# EasyEDA Pro project slimarm_apricot.eprj, board PCB1
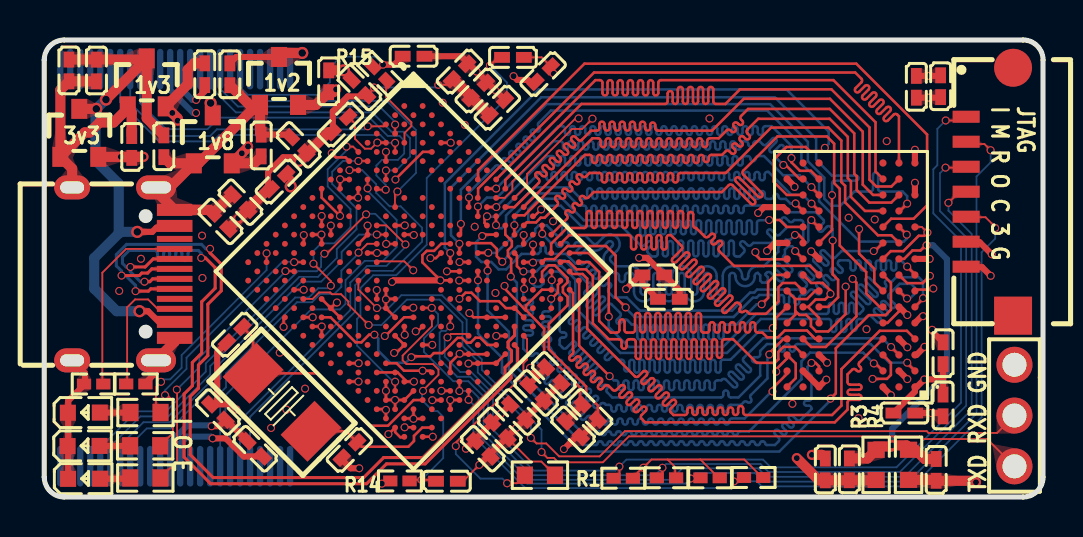
[diagram p1: board, top side]
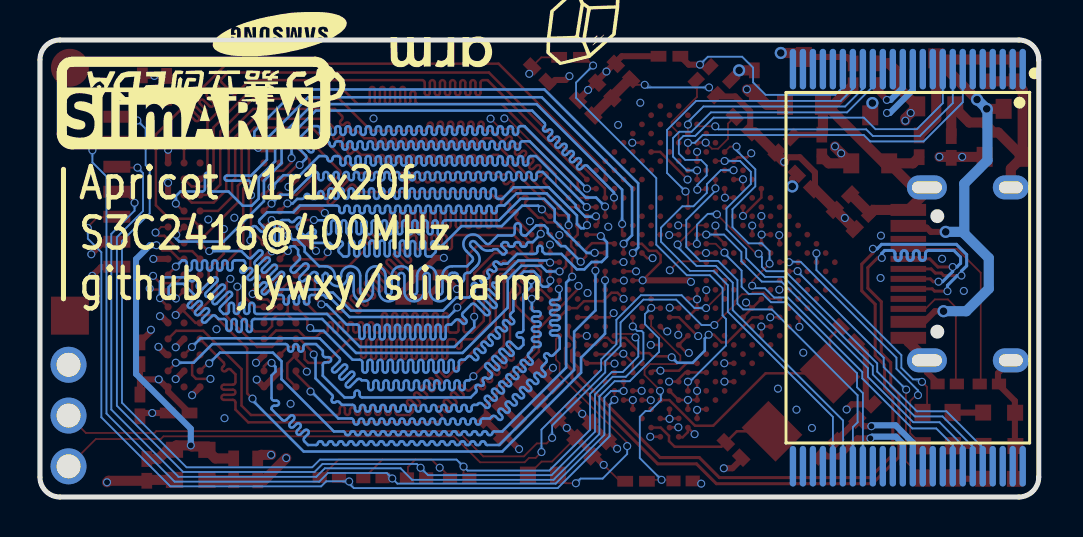
[diagram p2: board, bottom side, seen from below]

Outline 49.98 x 22.86 mm; copper layers: Top Layer, Inner1, Inner2, Bottom Layer. Coordinates in mm from the lower left corner of the outline.
Outline path: 0,21.86 0,1 arc(0.29,0.29) 1,0 48.98,0 arc(49.69,0.29) 49.98,1 49.98,21.86 arc(49.69,22.57) 48.98,22.86 1,22.86 arc(0.29,22.57) 0,21.86
Stack: Top Layer 0.035mm / Dielectric1 0.347mm PP er 4.5 / Inner1 0.035mm / Dielectric2 0.347mm FR4 er 4.5 / Inner2 0.035mm / Dielectric3 0.347mm PP er 4.5 / Bottom Layer 0.035mm

## Design rules (mm)
net DDR_CLKN: DDRCLK
net DDR_CLKP: DDRCLK
net USB_DN: USB
net USB_DP: USB
template: 自定义配置
spacing copperThickness1oz (default): track to track 0.089, other pairs 0.089 to 0.3
spacing copperThickness2oz: track to track 0.203, other pairs 0.152 to 0.3
track width copperThickness1oz (default): min 0.089, default 0.089, max 2.54
track width copperThickness2oz: min 0.089, default 0.089, max 2.54
differential pair DDRCLK (default): width min 0.089, default 0.127, max 2.54; gap min 0.203, default 0.203
differential pair USB: width min 0.142, default 0.142, max 2.54; gap min 0.152, default 0.152
via viaSize (default): diameter min 0.399, default 0.399, max 10; hole min 0.3, default 0.3, max 6.299
net DDR_D14 uses DDR
net DDR_D12 uses DDR
net DDR_D6 uses DDR
net DDR_D9 uses DDR
net DDR_D1 uses DDR
net DDR_A14_BA0 uses DDR
net DDR_A10 uses DDR
net DDR_A3 uses DDR
net DDR_A7 uses DDR
net DDR_A12 uses DDR
net DDR_D11 uses DDR
net DDR_D3 uses DDR
net DDR_A15_BA1 uses DDR
net DDR_A1 uses DDR
net DDR_A5 uses DDR
net DDR_A9 uses DDR
net DDR_D10 uses DDR
net DDR_D2 uses DDR
net DDR_A2 uses DDR
net DDR_A6 uses DDR
net DDR_A11 uses DDR
net DDR_D8 uses DDR
net DDR_D0 uses DDR
net DDR_A0 uses DDR
net DDR_A4 uses DDR
net DDR_A8 uses DDR
net DDR_D15 uses DDR
net DDR_D13 uses DDR
net DDR_D7 uses DDR
net DDR_D5 uses DDR
net DDR_RAS uses DDR
net DDR_UDQS uses DDR
net DDR_CS uses DDR
net DDR_CLKN uses DDR
net DDR_WE uses DDR
net DDR_D4 uses DDR
net DDR_LDQS uses DDR
net DDR_UDQM uses DDR
net DDR_SCKE uses DDR
net DDR_LDQM uses DDR
net DDR_CLKP uses DDR
net DDR_CAS uses DDR
net USB_DN uses USB
net USB_DP uses USB
diff pair USB uses USB
eq len grp DDR uses DDR
pour e13763 uses copperRegion1
pour e1405 uses copperRegion1

## Placement (name value [footprint] x y rotation side)
C1  22pF  [C0402]  15.28 2.35 45 top
C2  22pF  [C0402]  9.53 8.12 45 top
C3  100nF  [C0402]  44.64 1.36 90 top
C4  100nF  [C0402]  40.29 1.38 90 top
C5  100nF  [C0402]  1.24 21.34 270 top
C6  100nF  [C0402]  4.38 17.51 90 top
C7  100nF  [C0402]  5.99 17.54 270 top
C8  100nF  [C0402]  8.03 21.15 270 top
C9  100nF  [C0402]  2.61 21.33 270 top
C10  100nF  [C0402]  10.86 17.58 90 top
C11  100nF  [C0402]  9.29 21.14 270 top
C12  100nF  [C0402]  14.23 20.8 90 top
C13  100nF  [C0402]  14.83 18.63 45 top
C14  100nF  [C0402]  20.78 21.28 45 top
C15  100nF  [C0402]  11.72 15.78 45 top
C17  100nF  [C0402]  15.77 20.49 135 top
C18  100nF  [C0402]  12.73 17.61 135 top
C19  100nF  [C0402]  9.82 14.75 135 top
C20  100nF  [C0402]  8.82 13.79 135 top
C22  100nF  [C0402]  31.26 9.89 0 top
C23  100nF  [C0402]  30.48 11.11 0 top
C24  100nF  [C0402]  24.97 21.15 45 top
C25  100nF  [C0402]  26.46 3.39 315 top
C26  100nF  [C0402]  27.32 4.26 315 top
C27  100nF  [C0402]  22.67 19.47 45 top
C28  100nF  [C0402]  21.72 20.34 45 top
C30  100nF  [C0402]  21.95 2.41 315 top
C31  100nF  [C0402]  23.7 4.25 315 top
C32  100nF  [C0402]  8.69 4.25 135 top
C33  100nF  [C0402]  22.8 3.34 315 top
C34  100nF  [C0402]  10.55 2.41 315 top
C35  100nF  [C0402]  25.5 6.11 315 top
C36  100nF  [C0402]  24.62 5.2 315 top
C37  100nF  [C0402]  43.64 20.52 90 top
C38  100nF  [C0402]  44.86 20.55 90 top
C39  100nF  [C0402]  39.09 1.38 90 top
C40  100nF  [C0402]  43.04 4.2 0 top
C41  100nF  [C0402]  44.98 4.58 270 top
C42  100nF  [C0402]  44.98 7.19 90 top
C43  100nF  [C0402]  18.48 22.05 0 top
C44  100nF  [C0402]  20.15 0.79 0 top
C45  100nF  [C0402]  23.46 21.99 0 top
CN1  AFC12-S07DCA-00  [conn-smd_afc12-s07dca-00]  47.55 15.27 90 top
H1  2.54-1*3P针  [hdr-th_3p-p2.54-v-m-1]  48.55 4.07 270 top
LED1  NCD0603R1  [LED0603-RD_RED]  1.97 2.55 0 top
LED2  NCD0603R1  [LED0603-RD_RED]  1.98 4.22 0 top
LED3  NCD0603R1  [LED0603-RD_RED]  2 0.91 0 top
R1  44.2Ω  [R0603]  24.81 1.09 0 top
R3  2kΩ  [R0603]  41.63 1.61 270 top
R4  2kΩ  [R0603]  43.25 1.61 90 top
R5  1kΩ  [R0603]  5.05 2.56 180 top
R6  1kΩ  [R0603]  5.07 4.23 180 top
R7  1kΩ  [R0603]  5.06 0.95 180 top
R8  5.1kΩ  [R0402]  2.47 5.65 0 top
R9  5.1kΩ  [R0402]  4.58 5.65 180 top
R10  10kΩ  [R0402]  28.98 0.94 0 top
R11  10kΩ  [R0402]  33.32 0.96 0 top
R12  10kΩ  [R0402]  31.14 0.96 0 top
R13  5.1kΩ  [R0402]  35.5 0.98 0 top
R14  5.1kΩ  [R0402]  17.8 0.8 180 top
R15  5.1kΩ  [R0402]  16.8 21.18 135 top
U1  S3C2416_SCH  [S3C2416-XH40]  18.48 11.28 315 top
U3  K9F2G08U0C-SCBO  [tsop-48_l12.0-w18.4-p0.50-ls20.0-bl]  6.55 11.47 0 bottom
U4  NT5TU32M16FG-AC  [VFBGA-84_L7.5-W12.2-P0.80-TL_NANYA_NT5TU32M16FG]  40.37 11.11 180 top
U6  XC6206-3.3V  [SSOT-3_L2.9-W1.6-P0.95-LS2.8-BR]  1.76 18.21 270 top
U7  XC6206-3.3V  [SSOT-3_L2.9-W1.6-P0.95-LS2.8-BR]  5.13 20.74 270 top
U8  XC6206-3.3V  [SSOT-3_L2.9-W1.6-P0.95-LS2.8-BR]  8.43 17.89 270 top
U9  XC6206-3.3V  [SSOT-3_L2.9-W1.6-P0.95-LS2.8-BR]  11.75 20.81 270 top
USB2  TYPE-C 16PIN 2MD(073)  [USB-C-SMD_TYPE-C-6PIN-2MD-073]  3.77 11.16 270 top
X2  12MHz  [CRYSTAL-SMD_L5.0-W3.2]  11.9 4.74 315 top

## Footprints (pads in the part's own frame, mm; a bottom-side part is the same pattern mirrored in y, then rotated)
C0402
  rect 0.79x0.54 smd: 1(-0.545,0) 2(0.545,0)
conn-smd_afc12-s07dca-00
  rect 0.6x1.35 smd: 1(3.75,1.417) 2(2.5,1.417) 3(1.25,1.417) 4(0,1.417) 5(-1.25,1.417) 6(-2.5,1.417) 7(-3.75,1.417)
  rect 1.9x1.9 smd: 8(-6.2,-0.931)
  rrect 1.9x1.9 smd: 9(6.2,-0.931)
CRYSTAL-SMD_L5.0-W3.2
  rect 1.9x2.4 smd: 1(-2.05,0) 2(2.05,0)
hdr-th_3p-p2.54-v-m-1
  round 1.8 hole 1.2: 1(-2.54,0) 2(0,0) 3(2.54,0)
LED0603-RD_RED
  rect 0.8x0.8 smd: 1(-0.799,-0.004) 2(0.799,0.004)
R0402
  rect 0.711x0.54 smd: 1(-0.482,0) 2(0.482,0)
R0603
  rect 0.806x0.864 smd: 1(-0.753,0) 2(0.753,0)
S3C2416-XH40
  round 0.29 smd: A2(-5.525,6.175) A3(-4.875,6.175) A4(-4.225,6.175) A5(-3.575,6.175) A6(-2.925,6.175) A7(-2.275,6.175) A8(-1.625,6.175) A9(-0.975,6.175) A10(-0.325,6.175) A11(0.325,6.175) A12(0.975,6.175) A13(1.625,6.175) A14(2.275,6.175) A15(2.925,6.175) A16(3.575,6.175) A17(4.225,6.175) A18(4.875,6.175) A19(5.525,6.175) B1(-6.175,5.525) B2(-5.525,5.525) B3(-4.875,5.525) B4(-4.225,5.525) B5(-3.575,5.525) B6(-2.925,5.525) B7(-2.275,5.525) B8(-1.625,5.525) B9(-0.975,5.525) B10(-0.325,5.525) B11(0.325,5.525) B12(0.975,5.525) B13(1.625,5.525) B14(2.275,5.525) B15(2.925,5.525) B16(3.575,5.525) B17(4.225,5.525) B18(4.875,5.525) B19(5.525,5.525) B20(6.175,5.525) C1(-6.175,4.875) C2(-5.525,4.875) C3(-4.875,4.875) C4(-4.225,4.875) C5(-3.575,4.875) C6(-2.925,4.875) C7(-2.275,4.875) C8(-1.625,4.875) C9(-0.975,4.875) C10(-0.325,4.875) C11(0.325,4.875) C12(0.975,4.875) C13(1.625,4.875) C14(2.275,4.875) C15(2.925,4.875) C16(3.575,4.875) C17(4.225,4.875) C18(4.875,4.875) C19(5.525,4.875) C20(6.175,4.875) D1(-6.175,4.225) D2(-5.525,4.225) D3(-4.875,4.225) D4(-4.225,4.225) D5(-3.575,4.225) D6(-2.925,4.225) D7(-2.275,4.225) D8(-1.625,4.225) D9(-0.975,4.225) D10(-0.325,4.225) D11(0.325,4.225) D12(0.975,4.225) D13(1.625,4.225) D14(2.275,4.225) D15(2.925,4.225) D16(3.575,4.225) D17(4.225,4.225) D18(4.875,4.225) D19(5.525,4.225) D20(6.175,4.225) E1(-6.175,3.575) E2(-5.525,3.575) E3(-4.875,3.575) E4(-4.225,3.575) E17(4.225,3.575) E18(4.875,3.575) E19(5.525,3.575) E20(6.175,3.575) F1(-6.175,2.925) F2(-5.525,2.925) F3(-4.875,2.925) F4(-4.225,2.925) F7(-2.275,2.925) F8(-1.625,2.925) F9(-0.975,2.925) F10(-0.325,2.925) F11(0.325,2.925) F12(0.975,2.925) F13(1.625,2.925) F14(2.275,2.925) F17(4.225,2.925) F18(4.875,2.925) F19(5.525,2.925) F20(6.175,2.925) G1(-6.175,2.275) G2(-5.525,2.275) G3(-4.875,2.275) G4(-4.225,2.275) G6(-2.925,2.275) G8(-1.625,2.275) G9(-0.975,2.275) G10(-0.325,2.275) G11(0.325,2.275) G12(0.975,2.275) G13(1.625,2.275) G14(2.275,2.275) G15(2.925,2.275) G17(4.225,2.275) G18(4.875,2.275) G19(5.525,2.275) G20(6.175,2.275) H1(-6.175,1.625) H2(-5.525,1.625) H3(-4.875,1.625) H4(-4.225,1.625) H6(-2.925,1.625) H7(-2.275,1.625) H8(-1.625,1.625) H9(-0.975,1.625) H10(-0.325,1.625) H11(0.325,1.625) H12(0.975,1.625) H13(1.625,1.625) H14(2.275,1.625) H15(2.925,1.625) H17(4.225,1.625) H18(4.875,1.625) H19(5.525,1.625) H20(6.175,1.625) J1(-6.175,0.975) J2(-5.525,0.975) J3(-4.875,0.975) J4(-4.225,0.975) J6(-2.925,0.975) J7(-2.275,0.975) J8(-1.625,0.975) J13(1.625,0.975) J14(2.275,0.975) J15(2.925,0.975) J17(4.225,0.975) J18(4.875,0.975) J19(5.525,0.975) J20(6.175,0.975) K1(-6.175,0.325) K2(-5.525,0.325) K3(-4.875,0.325) K4(-4.225,0.325) K6(-2.925,0.325) K7(-2.275,0.325) K8(-1.625,0.325) K13(1.625,0.325) K14(2.275,0.325) K15(2.925,0.325) K17(4.225,0.325) K18(4.875,0.325) K19(5.525,0.325) K20(6.175,0.325) L1(-6.175,-0.325) L2(-5.525,-0.325) L3(-4.875,-0.325) L4(-4.225,-0.325) L6(-2.925,-0.325) L7(-2.275,-0.325) L8(-1.625,-0.325) L13(1.625,-0.325) L14(2.275,-0.325) L15(2.925,-0.325) L17(4.225,-0.325) L18(4.875,-0.325) L19(5.525,-0.325) L20(6.175,-0.325) M1(-6.175,-0.975) M2(-5.525,-0.975) M3(-4.875,-0.975) M4(-4.225,-0.975) M6(-2.925,-0.975) M7(-2.275,-0.975) M8(-1.625,-0.975) M13(1.625,-0.975) M14(2.275,-0.975) M15(2.925,-0.975) M17(4.225,-0.975) M18(4.875,-0.975) M19(5.525,-0.975) M20(6.175,-0.975) N1(-6.175,-1.625) N2(-5.525,-1.625) N3(-4.875,-1.625) N4(-4.225,-1.625) N6(-2.925,-1.625) N7(-2.275,-1.625) N8(-1.625,-1.625) N9(-0.975,-1.625) N10(-0.325,-1.625) N11(0.325,-1.625) N12(0.975,-1.625) N13(1.625,-1.625) N14(2.275,-1.625) N15(2.925,-1.625) N17(4.225,-1.625) N18(4.875,-1.625) N19(5.525,-1.625) N20(6.175,-1.625) P1(-6.175,-2.275) P2(-5.525,-2.275) P3(-4.875,-2.275) P4(-4.225,-2.275) P6(-2.925,-2.275) P7(-2.275,-2.275) P8(-1.625,-2.275) P9(-0.975,-2.275) P10(-0.325,-2.275) P11(0.325,-2.275) P12(0.975,-2.275) P13(1.625,-2.275) P15(2.925,-2.275) P17(4.225,-2.275) P18(4.875,-2.275) P19(5.525,-2.275) P20(6.175,-2.275) R1(-6.175,-2.925) R2(-5.525,-2.925) R3(-4.875,-2.925) R4(-4.225,-2.925) R7(-2.275,-2.925) R8(-1.625,-2.925) R9(-0.975,-2.925) R10(-0.325,-2.925) R11(0.325,-2.925) R12(0.975,-2.925) R13(1.625,-2.925) R14(2.275,-2.925) R17(4.225,-2.925) R18(4.875,-2.925) R19(5.525,-2.925) R20(6.175,-2.925) T1(-6.175,-3.575) T2(-5.525,-3.575) T3(-4.875,-3.575) T4(-4.225,-3.575) T17(4.225,-3.575) T18(4.875,-3.575) T19(5.525,-3.575) T20(6.175,-3.575) U1(-6.175,-4.225) U2(-5.525,-4.225) U3(-4.875,-4.225) U4(-4.225,-4.225) U5(-3.575,-4.225) U6(-2.925,-4.225) U7(-2.275,-4.225) U8(-1.625,-4.225) U9(-0.975,-4.225) U10(-0.325,-4.225) U11(0.325,-4.225) U12(0.975,-4.225) U13(1.625,-4.225) U14(2.275,-4.225) U15(2.925,-4.225) U16(3.575,-4.225) U17(4.225,-4.225) U18(4.875,-4.225) U19(5.525,-4.225) U20(6.175,-4.225) V1(-6.175,-4.875) V2(-5.525,-4.875) V3(-4.875,-4.875) V4(-4.225,-4.875) V5(-3.575,-4.875) V6(-2.925,-4.875) V7(-2.275,-4.875) V8(-1.625,-4.875) V9(-0.975,-4.875) V10(-0.325,-4.875) V11(0.325,-4.875) V12(0.975,-4.875) V13(1.625,-4.875) V14(2.275,-4.875) V15(2.925,-4.875) V16(3.575,-4.875) V17(4.225,-4.875) V18(4.875,-4.875) V19(5.525,-4.875) V20(6.175,-4.875) W1(-6.175,-5.525) W2(-5.525,-5.525) W3(-4.875,-5.525) W4(-4.225,-5.525) W5(-3.575,-5.525) W6(-2.925,-5.525) W7(-2.275,-5.525) W8(-1.625,-5.525) W9(-0.975,-5.525) W10(-0.325,-5.525) W11(0.325,-5.525) W12(0.975,-5.525) W13(1.625,-5.525) W14(2.275,-5.525) W15(2.925,-5.525) W16(3.575,-5.525) W17(4.225,-5.525) W18(4.875,-5.525) W19(5.525,-5.525) W20(6.175,-5.525) Y2(-5.525,-6.175) Y3(-4.875,-6.175) Y4(-4.225,-6.175) Y5(-3.575,-6.175) Y6(-2.925,-6.175) Y7(-2.275,-6.175) Y8(-1.625,-6.175) Y9(-0.975,-6.175) Y10(-0.325,-6.175) Y11(0.325,-6.175) Y12(0.975,-6.175) Y13(1.625,-6.175) Y14(2.275,-6.175) Y15(2.925,-6.175) Y16(3.575,-6.175) Y17(4.225,-6.175) Y18(4.875,-6.175) Y19(5.525,-6.175)
SSOT-3_L2.9-W1.6-P0.95-LS2.8-BR
  rect 1x0.8 smd: 1(1.2,-0.95) 2(1.2,0.95) 3(-1.2,0)
tsop-48_l12.0-w18.4-p0.50-ls20.0-bl
  oval 0.318x2.032 smd: 1(-5.75,-9.931) 2(-5.25,-9.931) 3(-4.75,-9.931) 4(-4.25,-9.931) 5(-3.75,-9.931) 6(-3.25,-9.931) 7(-2.75,-9.931) 8(-2.25,-9.931) 9(-1.75,-9.931) 10(-1.25,-9.931) 11(-0.75,-9.931) 12(-0.25,-9.931) 13(0.25,-9.931) 14(0.75,-9.931) 15(1.25,-9.931) 16(1.75,-9.931) 17(2.25,-9.931) 18(2.75,-9.931) 19(3.25,-9.931) 20(3.75,-9.931) 21(4.25,-9.931) 22(4.75,-9.931) 23(5.25,-9.931) 24(5.75,-9.931) 25(5.75,9.931) 26(5.25,9.931) 27(4.75,9.931) 28(4.25,9.931) 29(3.75,9.931) 30(3.25,9.931) 31(2.75,9.931) 32(2.25,9.931) 33(1.75,9.931) 34(1.25,9.931) 35(0.75,9.931) 36(0.25,9.931) 37(-0.25,9.931) 38(-0.75,9.931) 39(-1.25,9.931) 40(-1.75,9.931) 41(-2.25,9.931) 42(-2.75,9.931) 43(-3.25,9.931) 44(-3.75,9.931) 45(-4.25,9.931) 46(-4.75,9.931) 47(-5.25,9.931) 48(-5.75,9.931)
USB-C-SMD_TYPE-C-6PIN-2MD-073
  rect 0.6x1.778 smd: 1(-3.2,2.756) 2(-2.4,2.756) 11(2.4,2.756) 12(3.2,2.756)
  rect 0.3x1.778 smd: 3(-1.75,2.756) 4(-1.25,2.756) 5(-0.75,2.756) 6(-0.25,2.756) 7(0.25,2.756) 8(0.75,2.756) 9(1.25,2.756) 10(1.75,2.756)
  oval 1.2x2 hole 0.6x1.5: 13(-4.325,1.825) 14(4.325,1.825)
  oval 1.2x1.8 hole 0.6x1.2: 13(-4.325,-2.375) 14(4.325,-2.375)
VFBGA-84_L7.5-W12.2-P0.80-TL_NANYA_NT5TU32M16FG
  round 0.36 smd: A1(-3.2,5.6) A2(-2.4,5.6) A3(-1.6,5.6) A7(1.6,5.6) A8(2.4,5.6) A9(3.2,5.6) B1(-3.2,4.8) B2(-2.4,4.8) B3(-1.6,4.8) B7(1.6,4.8) B8(2.4,4.8) B9(3.2,4.8) C1(-3.2,4) C2(-2.4,4) C3(-1.6,4) C7(1.6,4) C8(2.4,4) C9(3.2,4) D1(-3.2,3.2) D2(-2.4,3.2) D3(-1.6,3.2) D7(1.6,3.2) D8(2.4,3.2) D9(3.2,3.2) E1(-3.2,2.4) E2(-2.4,2.4) E3(-1.6,2.4) E7(1.6,2.4) E8(2.4,2.4) E9(3.2,2.4) F1(-3.2,1.6) F2(-2.4,1.6) F3(-1.6,1.6) F7(1.6,1.6) F8(2.4,1.6) F9(3.2,1.6) G1(-3.2,0.8) G2(-2.4,0.8) G3(-1.6,0.8) G7(1.6,0.8) G8(2.4,0.8) G9(3.2,0.8) H1(-3.2,0) H2(-2.4,0) H3(-1.6,0) H7(1.6,0) H8(2.4,0) H9(3.2,0) J1(-3.2,-0.8) J2(-2.4,-0.8) J3(-1.6,-0.8) J7(1.6,-0.8) J8(2.4,-0.8) J9(3.2,-0.8) K2(-2.4,-1.6) K3(-1.6,-1.6) K7(1.6,-1.6) K8(2.4,-1.6) K9(3.2,-1.6) L1(-3.2,-2.4) L2(-2.4,-2.4) L3(-1.6,-2.4) L7(1.6,-2.4) L8(2.4,-2.4) M2(-2.4,-3.2) M3(-1.6,-3.2) M7(1.6,-3.2) M8(2.4,-3.2) M9(3.2,-3.2) N1(-3.2,-4) N2(-2.4,-4) N3(-1.6,-4) N7(1.6,-4) N8(2.4,-4) P2(-2.4,-4.8) P3(-1.6,-4.8) P7(1.6,-4.8) P8(2.4,-4.8) P9(3.2,-4.8) R1(-3.2,-5.6) R2(-2.4,-5.6) R3(-1.6,-5.6) R7(1.6,-5.6) R8(2.4,-5.6)

## Nets
As in the schematic.

Pads without a net: CN1 8 9; U1 A2 A3 A4 A5 A6 A7 A8 A9 B1 B2 B3 B4 B6 B7 B8 B15 B16 C1 C2 C3 C4 C6 C7 C8 C9 D4 D5 D6 D7 D8 D9 D14 D20 E1 E4 E18 E19 E20 F1 F2 F4 F7 F8 F9 F10 F17 F18 F19 F20 G3 G6 G8 G9 G10 G15 G17 G20 H7 H8 H9 H10 H15 H17 J1 J4 J6 J14 J15 J18 K1 K4 K13 K14 K15 K17 K18 L2 L4 L13 L14 L18 M1 M2 M3 M4 M15 M17 M20 N1 N2 N6 N7 N8 N9 N15 N17 N18 N19 N20 P1 P2 P6 P7 P9 P17 R1 R2 R4 R7 R8 R9 R10 R11 R12 R18 T1 T2 T3 T17 T18 U1 U2 U3 U5 U6 U10 U11 U12 U13 U19 U20 V1 V3 V4 V7 V9 V10 V11 V12 V13 W1 W2 W3 W4 W5 W6 W10 W11 W13 W14 W15 Y2 Y3 Y4 Y5 Y7 Y8 Y9 Y10 Y11 Y12 Y14 Y15; U3 1 2 3 4 5 6 10 11 14 15 20 21 22 23 24 25 26 27 28 33 34 35 38 39 40 45 46 47 48; U4 A2 A8 E2 E8 R3 R7 R8; USB2 3 9

## Via types
v1: diameter 0.4, hole 0.3, Top Layer to Bottom Layer, 234 vias
v2: diameter 0.399, hole 0.299, Top Layer to Bottom Layer, 25 vias
v3: diameter 0.61, hole 0.381, Top Layer to Bottom Layer, 8 vias

## Routing (per net, layer and track width the routed paths; a pad name or vN(x,y) marks a point on that pad's centre or on a via; arc(x,y) is an arc through that point)
1V2: length 36.5
  Top Layer w0.127: 23.07,8.07 23.06,8.06 v1(22.62,8.06) ; 20.32,5.31 v1(19.88,5.31)
  Top Layer w0.305: 24.7,6.06 C36.1 ; 24.7,6.06 25.12,6.47 C35.1 ; 24.7,6.06 24.7,6.08 v1(24.31,6.46)
  Top Layer w0.508: U9.2 13.59,19.61 C12.1 14.47,20.25 v1(14.61,20.39)
  Inner1 w0.127: 18.88,7.19 18.88,7.79 19.3,8.2 19.3,8.78 19.89,9.36 19.89,10.06 20.21,10.39 21.52,10.39 22.12,9.79 22.95,9.79 23.32,9.43 23.32,8.75 v1(22.62,8.06)
  Inner1 w0.305: v1(14.61,20.39) 15.34,19.66 17.51,19.66 18.21,18.96 18.21,17.94 18.89,17.26 18.89,14.22 19.2,13.91 19.2,12.77 17.91,11.48 17.91,9.75 17.53,9.37 17.53,7.97 17.84,7.67 18.41,7.67 18.88,7.19 19.88,6.2 v1(19.88,5.31) ; v1(22.62,8.06) 22.72,8.06 v1(24.31,6.46)
1V3: length 76.6
  Top Layer w0.089: 20.48,20.89 20.2,20.62 v2(19.72,20.62) ; v2(16.5,20.49) 16.5,20.44 C17.1 ; 12.5,10.37 v1(12.98,10.37)
  Top Layer w0.127: 13.88,13.59 v1(13.88,14.06) ; 13.42,8.53 v1(13.89,8.53) 13.88,8.52 13.88,8.07 ; v1(20.78,11.75) 21.23,11.75 21.24,11.75 ; 16.64,4.39 17.07,4.39 v1(17.1,4.36) 17.1,3.93 ; 20.32,10.83 20.31,10.84 v1(19.82,10.84) 18.93,11.74 18.93,12.1 19.14,12.31 19.51,12.31 19.86,12.67 20.32,12.67 ; v1(12.99,13.1) 12.99,12.69 12.96,12.67 ; 16.18,12.21 v1(16.65,12.21) 17.1,12.21 ; v1(18.59,8.29) 18.69,8.29 18.94,8.53 ; 18.02,13.13 18.47,13.13 v1(18.5,13.1) ; 15.26,15.88 14.81,15.88 v1(14.8,15.89) 14.8,15.42 ; 16.64,9.91 v1(16.64,10.35)
  Top Layer w0.305: C15.1 11.2,15.53 11.2,16.24 11.95,16.99 12.52,16.99 v1(12.75,16.76) ; v1(19.82,10.84) 17.48,10.84 v1(17.41,10.76) ; C13.1 14.44,19.29 15.19,20.04 15.92,20.04
  Top Layer w0.508: C20.1 11.2,15.39 C15.1 ; C13.1 14.23,18.25 v1(12.75,16.76) ; C8.1 7.5,21.69 7.18,21.37 7.18,20.64 U7.2 v1(6.41,19.21) 6.67,18.94 v1(6.67,18.82) ; 22.29,19.09 20.48,20.89 C14.1
  Inner1 w0.127: v1(20.78,11.75) 20.59,11.56 20.59,11.19 20.33,10.93 19.92,10.93 v1(19.82,10.84) 18.96,9.97 18.96,8.65 v1(18.59,8.29)
  Inner1 w0.254: 17.12,11.74 17.59,12.21 17.59,12.87 17.84,13.11 18.49,13.11 v1(18.5,13.1)
  Inner1 w0.305: v1(13.88,14.06) 13.88,15.63 v1(12.75,16.76) ; v1(13.88,14.06) 12.99,13.17 ; v1(13.88,14.06) 14.8,14.98 v1(14.8,15.89) ; v1(17.1,4.36) 16.45,5 16.45,6.94 15.6,7.79 ; 12.99,13.1 12.99,10.4 13.02,10.37 ; 13.02,10.37 v1(12.98,10.37) ; 13.02,10.37 14.86,8.53 ; 14.86,8.53 v1(13.89,8.53) ; 14.86,8.53 15.6,7.79 ; v1(16.65,12.21) 17.41,11.45 v1(17.41,10.76) 17,10.35 v1(16.64,10.35) 15.6,9.32 15.6,7.79
  Inner1 w0.508: 12.99,13.1 12.14,13.95 v1(9.7,13.95) 8.06,15.6 8.06,16.74 6.67,18.13 v1(6.67,18.82) 6.67,18.94 v1(6.41,19.21)
  Bottom Layer w0.089: v2(16.5,20.49) 19.59,20.49 v2(19.72,20.62)
1V8: length 194
  Top Layer w0.089: v1(27.43,18.92) 26.92,18.41 26.41,18.41 24.16,16.16 24.16,15.59 23.53,14.96
  Top Layer w0.127: 26.94,4.64 26.81,4.77 26.81,5.48 25.02,7.27 25.02,8.41 24.12,9.34 24.1,9.34 ; v1(41.45,5.91) 42.17,5.91 42.37,6.11 42.37,6.71 41.97,7.11 ; 43.57,10.31 43.64,10.38 44.44,10.38 v1(44.49,10.43) ; 37.58,9.31 37.78,9.11 38.13,9.11 38.37,8.87 38.37,8.55 38.63,8.28 39.24,8.28 40.11,9.15 v1(40.11,10.52) ; 37.58,9.31 37.58,9.9 ; 37.58,9.31 37.58,9.12 37.17,8.71 ; 37.17,5.51 37.61,5.94 37.61,6.68 37.17,7.11 37.17,6.93 36.63,6.39 v1(36.63,6.27) ; 18.02,9.45 18.04,9.47 v1(18.47,9.47) ; 37.17,11.91 37.16,11.89 35.82,11.89 35.59,12.12 v1(35.59,12.25) ; 24.1,9.34 24.09,9.34 23.03,10.43 v1(23.03,10.56) ; 24.1,9.34 24.11,9.35 24.11,9.57 24.91,10.37 25.37,10.37 ; 37.58,9.9 38.17,9.9 38.58,10.31 38.77,10.31 ; 37.58,9.9 37.17,10.31 ; v1(24.46,12.63) 24.46,12.21 24.45,12.21 ; 41.97,10.31 41.54,10.74 41.54,11.41 40.78,12.17 v1(40.78,13.4) ; v1(18.04,8.11) 18.02,8.13 18.02,8.53 ; 21.24,10.83 v1(20.76,10.83)
  Top Layer w0.305: C22.1 29.94,10.67 C23.1 29.82,11.11 v1(29.12,10.4) ; C25.1 26.94,4.63 26.94,4.64 ; C42.1 44.98,5.89 ; 44.98,5.89 C41.1 ; 44.98,5.89 44.97,5.88 v1(44.04,5.88) 43.67,5.51 43.57,5.51 43.57,5.27 C40.1 ; 43.57,8.71 43.91,9.05 v1(43.98,9.05) ; 43.57,16.71 v1(43.57,17.37) ; 38.77,7.11 39.17,6.72 v1(39.17,6.72) ; 43.57,11.91 v1(44.31,11.91) ; v1(35.73,14.21) 36.02,14.5 36.98,14.5 37.17,14.31 ; 24.22,20.86 23.68,20.86 v2(23.49,21.05) ; v1(44.05,7.51) 43.65,7.11 43.57,7.11 ; C38.1 44.83,19.97 v1(44.25,19.97) C37.1
  Top Layer w0.508: v1(10.2,17.54) 10.2,17.5 v1(9.89,17.19) U8.2 10.51,16.69 C10.1 ; v1(37.66,1.95) 38.77,0.83 C39.1 41.61,0.83 R3.2
  Inner1 w0.089: 24.46,12.38 24.59,12.25 25.45,12.25 26.02,12.82 28.5,12.82 29.1,12.23 29.1,10.42 v1(29.12,10.4)
  Inner1 w0.127: 22.97,11.12 22.97,11.3 23.15,11.48 23.57,11.48 24.46,12.38 v1(24.46,12.63) ; 22.97,11.12 22.97,10.56 ; 22.97,11.12 22.36,11.73 21.28,11.73 ; v1(27.43,18.92) 27.33,18.92 26.85,18.45 26.28,18.45 22.79,14.96 21.8,14.96 21.25,15.51 21.25,15.52 20.13,15.52 19.54,14.93
  Inner1 w0.305: 43.43,5.27 41.29,3.13 38.41,3.13 37.66,2.38 v1(37.66,1.95) ; 43.43,5.27 42.99,5.27 42.35,5.91 v1(41.45,5.91) ; 43.43,5.27 v1(44.04,5.88) ; v1(40.78,13.4) 40.78,12.14 41.46,11.46 41.67,11.46 41.99,11.14 ; 40.11,9.23 v1(40.11,10.52) 39.85,10.77 39.85,11.76 37.2,14.42 35.94,14.42 v1(35.73,14.21) 35.59,14.07 v1(35.59,12.25) ; 40.11,9.23 38.12,7.24 ; 40.11,9.23 40.39,9.51 41.82,9.51 41.99,9.69 41.99,11.14 ; v1(39.17,6.72) 39.13,6.72 38.6,7.24 38.12,7.24 ; 41.99,11.14 42,11.13 42.44,11.13 43.14,10.43 v1(44.49,10.43) ; 17.19,22.31 18.96,20.54 18.96,18.18 19.54,17.59 19.54,14.24 19.86,13.92 ; v2(23.49,21.05) 22.59,21.95 22.59,22.31 ; v1(18.04,8.11) 18.04,9.04 v1(18.47,9.47) 18.45,9.49 18.45,10.43 19.86,11.84 19.86,13.92 ; 19.86,13.92 20.64,13.14 21.07,13.14 21.28,12.93 21.28,11.31 20.8,10.83 v1(20.76,10.83) ; 38.12,7.24 37.6,7.24 v1(36.63,6.27)
  Inner1 w0.508: v1(44.04,5.88) 44.04,7.55 ; 44.04,7.55 43.65,7.94 43.65,8.72 v1(43.98,9.05) 44.19,9.05 44.63,9.48 44.63,10.3 v1(44.49,10.43) 44.55,10.43 44.92,10.8 44.92,11.3 ; 44.04,7.55 44.05,7.54 v1(44.05,7.51) ; 44.92,11.3 44.92,11.48 44.49,11.91 v1(44.31,11.91) ; 44.92,11.3 45.03,11.4 45.03,13.43 44.34,14.11 44.34,16.6 v1(43.57,17.37) 44.08,17.88 44.08,19.8 v1(44.25,19.97) 41.92,22.31 14,22.31 10.2,18.5 v1(10.2,17.54) 10.2,17.5 v1(9.89,17.19)
3V3: length 127.6
  Top Layer w0.089: 17.37,0.8 17.23,0.67 v2(16.89,0.67) ; 32.84,1.88 31.19,1.88 ; 32.84,1.88 35.03,1.88 35.93,0.98 ; 32.84,1.88 33.75,0.96 ; 31.19,1.88 30.39,1.88 v2(29.98,1.47) 29.94,1.47 29.41,0.94 ; 31.19,1.88 31.57,1.5 31.57,0.96 ; R15.2 16.85,21.52 v2(16.96,21.63)
  Top Layer w0.127: v1(17.51,7.21) 17.62,7.21 18.02,7.61 17.56,8.07 ; 15.26,6.69 v1(15.74,6.69) ; 16.64,6.23 17.69,6.23 18.15,5.77 v1(18.5,5.77) ; v1(11.98,8.51) 11.98,8.92 12.04,8.99 ; 19.4,17.26 18.94,17.26 17.58,15.89 v1(17.58,15.88) ; 23.99,8.99 23.53,9.45 23.1,9.45 22.76,9.79 21.81,9.79 21.38,10.22 21.08,10.22 v1(20.78,9.91) ; U1.P18 20.32,6.71 20.78,7.17 v1(20.79,7.17) 20.81,7.14 22.15,7.14 22.16,7.15 ; 15.26,16.8 15.08,16.99 14.6,16.99 v1(14.39,17.2) ; 19.86,4.85 19.85,4.84 v1(19.42,4.84) ; 17.1,16.8 v1(17.1,17.27) ; U1.N4 v2(14.34,13.58) ; v1(18.04,3.49) 18.46,3.49 18.48,3.47 ; 18.94,3.01 v1(19.44,3.01)
  Top Layer w0.305: 46.29,12.75 46.81,12.75 v1(47.42,12.14) ; v1(21.1,2.41) v1(22.85,4.16) C31.1 ; 10.17,2.8 9.1,3.86 C32.1 8.75,3.54 v1(8.38,3.54) ; C43.1 17.52,21.63 v2(16.96,21.63)
  Top Layer w0.508: 4.97,17.01 v1(3.83,17.01) U6.2
  Inner1 w0.089: v1(20.78,9.91) 20.78,7.18 v1(20.79,7.17)
  Inner1 w0.127: 16.36,16.53 16.36,16.75 15.84,17.26 15.45,17.26 15.31,17.11 14.47,17.11 ; 16.36,16.53 16.36,16.41 16.89,15.88 v1(17.58,15.88) 18.19,15.88 18.3,15.77 18.3,15.05 17.79,14.54 15.89,14.54 14.92,13.58 v2(14.34,13.58) ; 16.36,16.53 v1(17.1,17.27) ; 14.47,17.11 14.43,17.11 ; 14.47,17.11 v1(14.39,17.2) ; 13.83,17.71 13.83,20.55 14.05,20.77 16.1,20.77 v2(16.96,21.63)
  Inner1 w0.305: 21.32,2.64 v1(22.85,4.16) 22.64,4.16 20.51,6.29 20.51,6.89 20.79,7.17 ; 21.32,2.64 21.32,3.68 20.66,4.34 19.92,4.34 v1(19.42,4.84) 18.61,4.84 18.5,4.96 v1(18.5,5.77) 18.5,5.99 17.8,6.69 17.8,6.92 v1(17.51,7.21) ; 21.32,2.64 v1(21.1,2.41) 20.75,2.06 20.1,2.06 19.54,2.62 19.54,2.92 v1(19.44,3.01) 19.32,3.14 18.39,3.14 v1(18.04,3.49) 17.79,3.73 16.47,3.73 15.03,5.18 15.03,5.68 ; 15.03,5.68 15.03,5.98 v1(15.74,6.69) ; 15.03,5.68 13.24,7.47 13.02,7.47 v1(11.98,8.51) 11.98,9.81 7.16,14.62 7.16,15.96 6.1,17.02 v1(4.97,17.02) 4.97,18.85 6.08,19.95 6.82,19.95 8.06,18.71 8.06,18.05 9.55,16.56 11.29,16.56 12.59,17.86 13.73,17.86 v1(14.39,17.2)
  Bottom Layer w0.089: 9.8,21.34 9.8,20.5 10.19,20.12 13.67,20.12 14.29,20.74 14.29,21.47 14.84,22.02 16.56,22.02 v2(16.96,21.63) ; 15.69,6.68 15.7,6.69 v1(15.74,6.69)
  Bottom Layer w0.305: 6.3,1.6 6.3,2.73 7.16,3.59 8.33,3.59 v1(8.38,3.54) ; v1(7.6,19.21) 7.45,19.21 6.3,20.36 6.3,21.34
5V: length 47.5
  Top Layer w0.305: v3(4.66,13.26) 5.4,13.26 5.62,13.48 6.44,13.48 USB2.2 ; USB2.11 6.47,8.7 5.79,8.7 5.2,9.29 v3(4.77,9.29) ; U8.3 8.33,19.2 v3(8.33,19.71) ; 9.29,21.69 9.61,22.01 11.75,22.01
  Top Layer w0.508: 5.13,21.92 5.09,21.88 ; 5.13,21.92 5.13,18.94 C7.1 ; 5.13,21.92 U7.3 ; 5.09,21.88 C5.1 ; 5.09,21.88 v3(3.09,19.88) ; v3(12.91,22.21) 11.95,22.21 11.75,22.01 ; v3(2.61,19.41) U6.3
  Inner1 w0.508: v3(2.61,19.41) 2.63,19.41 4.2,20.98 7.58,20.98 8.33,20.23 v3(8.33,19.71) 9.47,19.71 11.97,22.21 v3(12.91,22.21)
  Bottom Layer w0.508: v3(4.77,9.29) 3.63,9.29 2.5,10.42 2.5,11.95 3.73,13.18 ; 3.73,13.18 3.81,13.26 v3(4.66,13.26) ; 3.73,13.18 3.73,15.67 2.57,16.84 2.57,19.38 v3(2.61,19.41) 3.07,19.88 v3(3.09,19.88)
GND: length 161.3
  Top Layer w0.089: 37.97,9.51 38.22,9.51 ; v1(18.47,11.34) 18.02,11.79 16.6,11.79 16.64,11.75 ; 24,21.99 24.9,21.99 C24.2 ; C33.2 24.36,1.77 24.88,1.77 R1.2 ; v1(44.2,13.23) 43.92,13.51 U4.L1 ; v1(21.77,1.61) 20.96,0.79 C44.2 ; v1(26.74,18.94) 26.58,18.94 23.43,15.78 23.43,15.35 23.04,14.96 22.62,14.96 ; 16.66,17.73 16.35,17.42 16.04,17.42 15.55,17.91 15.55,18.68 15.21,19.02
  Top Layer w0.127: 15.72,15.42 15.71,15.41 v1(15.71,14.97) 15.27,14.97 15.26,14.96 ; v1(23.99,13.1) 23.99,12.67 23.99,12.67 ; 17.56,8.99 17.1,9.45 v1(17.1,9.89) ; 39.34,10.15 39.07,9.88 38.6,9.88 38.23,9.51 38.22,9.51 38.77,8.96 38.77,8.71 ; 41.97,11.91 42.36,12.3 42.99,12.3 43.76,13.07 44.04,13.07 v1(44.2,13.23) ; 19.4,6.23 19.31,6.32 v1(18.94,6.32) 18,6.32 17.63,6.69 17.1,6.69 ; 20.78,4.85 v1(20.32,4.85) 20.32,4.39 ; 18.02,4.85 17.56,4.85 ; 17.56,4.85 v1(17.56,4.86) 17.1,4.86 17.1,4.85 v1(17.1,5.31) 17.1,5.77 ; 17.56,4.85 17.56,4.39 ; v1(20.15,11.29) 20.78,11.29 ; 17.56,13.59 v1(18.04,13.59) ; v1(21.23,6.68) 21.68,6.68 21.7,6.69 22.62,6.69 23.07,7.15 ; 19.86,17.72 v1(20.34,17.72) ; 13.88,12.67 13.88,13.11 v1(13.87,13.13) 13.42,13.13 ; v1(18.48,3.91) 18.45,3.93 18.02,3.93 ; v1(18.48,3.91) 18.48,4.39 ; v1(18.48,3.91) 18.91,3.91 18.94,3.93 ; 12.96,8.99 v1(13.44,8.99) ; 24.91,10.83 24.91,11.26 25.24,11.59 25.54,11.59 26.18,10.95 26.18,10.73 25.96,10.5 25.96,10.24 26.19,10.01 26.19,9.6 25.25,8.66 25.25,7.39 27.12,5.53 27.12,5.16 27.71,4.57 C26.2 ; 17.56,9.91 17.12,9.91 v1(17.1,9.89) ; v1(17.1,9.89) 17.1,10.37 ; v2(17.22,3.14) 17.23,3.14 U1.Y18 17.56,3.25 17.82,2.99 18,2.99 18.02,3.01 ; v1(17.04,8.05) 17.07,8.05 18.01,8.99 18.48,8.99 ; 37.97,7.91 38.38,7.51 39.11,7.51 40.64,9.04 40.64,10.72 v1(40.45,10.91) ; 37.97,11.11 38.37,10.71 38.96,10.71 39.34,10.33 v1(39.34,10.16) ; 18.94,7.61 v1(19.42,7.61) ; U1.M6 U1.L6 v1(16.18,13.58) ; 23.07,8.99 21.48,8.99 v1(21.27,9.2) ; 41.97,8.71 42.2,8.71 42.77,9.28 42.77,9.51 ; v1(16.67,17.73) 17.09,17.73 17.1,17.72 ; 19.86,12.21 19.6,11.95 v1(19.33,11.95) ; 13.88,9.91 14.34,9.45 ; 14.34,9.45 14.8,8.99 ; 14.34,9.45 14.62,9.73 v1(14.65,9.73) ; 18.02,4.85 U1.U17 ; 15.26,5.77 v1(15.73,5.77) ; U1.L1 13.88,14.98 v1(14.8,14.06) 14.8,14.5 ; 42.77,11.11 43.18,10.7 43.96,10.7 v1(44.32,11.06)
  Top Layer w0.305: 8.51,4.64 8.66,4.78 8.66,7.24 C2.1 ; 8.51,4.64 C32.2 ; 8.51,4.64 9.36,4.64 v1(9.62,4.38) ; C38.2 44.83,21.06 v1(44.26,21.06) C37.2 ; C1.1 14.89,1.88 15.33,1.44 v1(15.76,1.44) ; v1(8.43,2.93) 9.08,2.93 9.99,2.03 C34.2 ; v1(38.38,12.29) 38.39,12.29 38.77,11.91 ; C26.2 27.71,3.86 C25.2 26.61,3 v1(26.01,2.4) ; C10.2 12.22,18.13 12.35,18 ; USB2.14 2.04,6.19 2.04,5.65 1.2,4.81 LED3.1 ; v1(36.17,12.31) 36.57,12.71 37.17,12.71 ; v3(12.34,15.53) 12.34,15.94 12.11,16.16 ; 5.01,5.65 5.6,6.24 USB2.14 ; 42.77,6.31 43.19,5.9 v1(43.19,5.9) ; 42.77,9.51 42.79,9.51 v1(43.19,9.1) ; C8.2 8.03,20.29 v1(7.6,19.86) ; v1(21.77,1.61) v1(23.62,3.46) C35.2 ; 38.77,5.51 37.97,6.31 ; C43.2 20.87,22.05 v2(21.63,21.28) v2(22.56,20.36) C27.2 ; C40.2 v1(44.37,4.2) 44.81,4.2 C41.2 ; v1(44.43,8.36) 44.43,8.28 C42.2 ; 46.29,11.5 46.93,11.5 v1(47.37,11.06) ; C22.2 31.8,10.33 C23.2 30.17,11.96 v1(29.77,11.96) ; 37.17,15.91 37.55,15.53 v1(37.55,15.51) ; 38.78,5.51 v1(39.14,5.87) ; v1(42.37,5.09) 41.97,5.49 41.97,5.51 ; 42.77,7.91 43.19,7.49 ; 43.57,15.11 v1(43.57,15.72)
  Top Layer w0.508: 4.18,19.44 4.38,19.24 C6.2 ; 4.18,19.44 3.48,18.73 2.77,18.73 2.27,18.23 2.03,18.23 0.81,17.01 ; 4.18,19.44 U7.1 ; C19.2 9.4,15.13 C20.2 8.25,14.36 USB2.1 5.6,15.29 USB2.13 6.28,15.49 U8.1 ; U8.1 6.3,16.69 C7.2 ; U8.1 7.72,16.69 10.65,19.61 ; 10.65,19.61 10.28,19.61 C11.2 ; 10.65,19.61 U9.1 10.8,18.19 C10.2 ; USB2.12 6.53,7.77 USB2.14 ; C39.2 38.9,2.11 v1(38.41,2.11) ; 0.81,17.01 1.4,16.42 USB2.13 ; 0.81,17.01 0.81,20.36 C5.2 2.61,20.79 C9.2 ; R4.1 44.59,0.86 C3.1 46.55,0.81 v1(46.63,0.74) ; 14.23,21.34 v3(14.99,21.34)
  Bottom Layer w0.305: 6.8,21.34 6.8,20.47 7.41,19.86 v1(7.6,19.86) ; 6.8,1.6 6.8,2.67 7.15,3.02 8.34,3.02 v1(8.43,2.93)
  vias: v1(3.75,10.31) v1(4.84,11.92) v1(7.9,13.07) v1(7.92,10.96) v1(11.35,3.45) v1(11.78,7.22) v1(12.12,4.37) v1(13.05,5.42) v1(21.54,13.52) v1(22.58,10.21) v1(25.47,13.79) v1(33.29,18.93) v1(37.44,4.66) v1(40.26,13.97) v1(40.75,3.94) v1(41.15,8.39) v1(41.56,13.88) v1(42.16,17.8) v1(43.19,7.49) v2(19.94,19.72) v2(21.05,18.61) v2(25.5,21.17)
DDR_A0: length 32.8
  Top Layer w0.127: 37.97,14.31 37.6,14.68 v1(37.6,14.68) ; 22.62,14.05 22.65,14.01 22.61,13.97 v1(22.61,13.6)
  Bottom Layer w0.127: v1(37.6,14.68) 37.34,14.68 37.11,14.91 36.87,14.91 arc(36.78,14.95) 36.74,15.04 arc(36.62,15.16) 36.49,15.04 arc(36.45,14.95) 36.36,14.91 36.18,14.91 arc(36.09,14.95) 36.06,15.04 36.06,15.18 arc(35.93,15.31) 35.8,15.18 35.8,15.04 arc(35.68,14.91) 35.55,15.04 35.55,15.32 arc(35.42,15.44) 35.3,15.32 35.3,15.04 arc(35.17,14.91) 35.04,15.04 35.04,15.32 arc(34.91,15.44) 34.79,15.32 34.79,15.04 arc(34.66,14.91) 34.53,15.04 34.53,15.32 arc(34.41,15.44) 34.28,15.32 34.28,15.04 arc(34.15,14.91) 34.03,15.04 34.03,15.32 arc(33.9,15.44) 33.77,15.32 33.77,15.04 arc(33.64,14.91) 33.52,15.04 33.52,15.32 arc(33.39,15.44) 33.26,15.32 33.26,15.04 arc(33.14,14.91) 33.01,15.04 33.01,15.32 arc(32.88,15.44) 32.76,15.32 32.76,15.04 arc(32.63,14.91) 32.5,15.04 32.5,15.32 arc(32.37,15.44) 32.25,15.32 32.25,15.04 arc(32.12,14.91) 31.99,15.04 31.99,15.32 arc(31.87,15.44) 31.74,15.32 31.74,15.04 arc(31.61,14.91) 31.49,15.04 31.49,15.32 arc(31.36,15.44) 31.23,15.32 31.23,15.04 arc(31.1,14.91) 30.98,15.04 30.98,15.32 arc(30.85,15.44) 30.72,15.32 30.72,15.04 arc(30.6,14.91) 30.47,15.04 30.47,15.32 arc(30.34,15.44) 30.22,15.32 30.22,15.04 arc(30.09,14.91) 29.96,15.04 29.96,15.32 arc(29.83,15.44) 29.71,15.32 29.71,15.04 arc(29.58,14.91) 29.45,15.04 29.45,15.32 arc(29.33,15.44) 29.2,15.32 29.2,15.04 arc(29.07,14.91) 28.95,15.04 28.95,15.32 arc(28.82,15.44) 28.69,15.32 28.69,15.04 arc(28.56,14.91) 28.44,15.04 28.44,15.32 arc(28.31,15.44) 28.18,15.32 28.18,15.04 arc(28.06,14.91) 27.93,15.04 27.93,15.32 arc(27.8,15.44) 27.68,15.32 27.68,15.04 arc(27.55,14.91) 27.42,15.04 27.42,15.32 arc(27.29,15.44) 27.17,15.32 27.17,15.04 arc(27.13,14.95) 27.04,14.91 26.86,14.91 26.28,15.49 24.52,15.49 23.11,14.08 23.11,13.65 22.9,13.44 22.76,13.44 v1(22.61,13.6)
DDR_A1: length 32.8
  Top Layer w0.127: 23.53,14.05 23.58,14.09 24.03,14.09 27.06,17.11 27.29,17.11 arc(27.38,17.07) 27.42,16.98 27.42,16.83 arc(27.54,16.7) 27.67,16.83 27.67,16.98 arc(27.8,17.11) 27.93,16.98 27.93,16.83 arc(28.05,16.7) 28.18,16.83 28.18,16.98 arc(28.31,17.11) 28.43,16.98 28.43,16.83 arc(28.56,16.7) 28.69,16.83 28.69,16.98 arc(28.81,17.11) 28.94,16.98 28.94,16.83 arc(29.07,16.7) 29.19,16.83 29.19,16.98 arc(29.32,17.11) 29.45,16.98 29.45,16.83 arc(29.58,16.7) 29.7,16.83 29.7,16.98 arc(29.83,17.11) 29.96,16.98 29.96,16.83 arc(30.08,16.7) 30.21,16.83 30.21,16.98 arc(30.34,17.11) 30.47,16.98 30.47,16.83 arc(30.59,16.7) 30.72,16.83 30.72,16.98 arc(30.85,17.11) 30.97,16.98 30.97,16.83 arc(31.1,16.7) 31.23,16.83 31.23,16.98 arc(31.35,17.11) 31.48,16.98 31.48,16.83 arc(31.61,16.7) 31.73,16.83 31.73,16.98 arc(31.86,17.11) 31.99,16.98 31.99,16.83 arc(32.12,16.7) 32.24,16.83 32.24,16.98 arc(32.37,17.11) 32.5,16.98 32.5,16.83 arc(32.62,16.7) 32.75,16.83 32.75,16.98 arc(32.88,17.11) 33,16.98 33,16.88 arc(33.13,16.75) 33.26,16.88 33.26,16.98 arc(33.3,17.07) 33.39,17.11 33.92,17.11 34.1,17.3 arc(34.19,17.33) 34.28,17.3 34.38,17.2 arc(34.56,17.2) 34.56,17.38 34.46,17.48 arc(34.46,17.66) 34.64,17.66 34.74,17.56 arc(34.92,17.56) 34.92,17.74 34.82,17.83 arc(34.82,18.01) 35,18.01 35.1,17.92 arc(35.28,17.92) 35.28,18.1 35.18,18.19 arc(35.15,18.28) 35.18,18.37 35.73,18.92 39.31,18.92 40.21,18.01 40.21,15.95 40.37,15.79 40.37,15.01 41.07,14.31 41.97,14.31
DDR_A2: length 32.9
  Top Layer w0.127: v1(38.4,14.67) 38.41,14.67 38.77,14.31 ; v1(22.16,14.04) 22.04,13.92 22.04,13.7 22.16,13.59
  Bottom Layer w0.127: v1(22.16,14.04) 22.18,14.02 22.69,14.02 23.17,14.5 23.17,14.61 24.83,16.26 25,16.26 arc(25.09,16.22) 25.13,16.13 25.13,15.96 arc(25.26,15.84) 25.39,15.96 25.39,16.13 arc(25.51,16.26) 25.64,16.13 25.64,15.96 arc(25.77,15.84) 25.89,15.96 25.89,16.13 arc(26.02,16.26) 26.15,16.13 26.15,15.96 arc(26.28,15.84) 26.4,15.96 26.4,16.13 arc(26.53,16.26) 26.66,16.13 26.66,15.96 arc(26.78,15.84) 26.91,15.96 26.91,16.13 arc(27.04,16.26) 27.16,16.13 27.16,15.96 arc(27.29,15.84) 27.42,15.96 27.42,16.13 arc(27.54,16.26) 27.67,16.13 27.67,15.96 arc(27.8,15.84) 27.93,15.96 27.93,16.13 arc(28.05,16.26) 28.18,16.13 28.18,15.96 arc(28.31,15.84) 28.43,15.96 28.43,16.13 arc(28.56,16.26) 28.69,16.13 28.69,15.96 arc(28.81,15.84) 28.94,15.96 28.94,16.13 arc(29.07,16.26) 29.2,16.13 29.2,15.96 arc(29.32,15.84) 29.45,15.96 29.45,16.13 arc(29.58,16.26) 29.7,16.13 29.7,15.96 arc(29.83,15.84) 29.96,15.96 29.96,16.13 arc(30.09,16.26) 30.21,16.13 30.21,15.96 arc(30.34,15.84) 30.47,15.96 30.47,16.13 arc(30.59,16.26) 30.72,16.13 30.72,15.96 arc(30.85,15.84) 30.97,15.96 30.97,16.13 arc(31.1,16.26) 31.23,16.13 31.23,15.96 arc(31.35,15.84) 31.48,15.96 31.48,16.13 arc(31.61,16.26) 31.74,16.13 31.74,15.96 arc(31.86,15.84) 31.99,15.96 31.99,16.13 arc(32.12,16.26) 32.24,16.13 32.24,15.96 arc(32.37,15.84) 32.5,15.96 32.5,16.13 arc(32.62,16.26) 32.75,16.13 32.75,15.96 arc(32.88,15.84) 33.01,15.96 33.01,16.13 arc(33.13,16.26) 33.26,16.13 33.26,15.96 arc(33.39,15.84) 33.51,15.96 33.51,16.13 arc(33.64,16.26) 33.77,16.13 33.77,15.96 arc(33.9,15.84) 34.02,15.96 34.02,16.13 arc(34.15,16.26) 34.28,16.13 34.28,15.96 arc(34.4,15.84) 34.53,15.96 34.53,16.13 arc(34.66,16.26) 34.78,16.13 34.78,15.96 arc(34.91,15.84) 35.04,15.96 35.04,16.13 arc(35.16,16.26) 35.29,16.13 35.29,15.96 arc(35.42,15.84) 35.55,15.96 35.55,16.13 arc(35.67,16.26) 35.8,16.13 35.8,15.96 arc(35.93,15.84) 36.05,15.96 36.05,16.13 arc(36.09,16.22) 36.18,16.26 36.24,16.26 37.38,15.12 37.95,15.12 v1(38.4,14.67)
DDR_A3: length 32.8
  Top Layer w0.127: 23.99,14.5 27.43,17.95 27.72,17.95 arc(27.81,17.91) 27.84,17.82 27.84,17.63 arc(27.97,17.5) 28.1,17.63 28.1,17.82 arc(28.22,17.95) 28.35,17.82 28.35,17.63 arc(28.48,17.5) 28.61,17.63 28.61,17.82 arc(28.73,17.95) 28.86,17.82 28.86,17.63 arc(28.99,17.5) 29.11,17.63 29.11,17.82 arc(29.24,17.95) 29.37,17.82 29.37,17.63 arc(29.49,17.5) 29.62,17.63 29.62,17.82 arc(29.75,17.95) 29.88,17.82 29.88,17.63 arc(30,17.5) 30.13,17.63 30.13,17.82 arc(30.26,17.95) 30.38,17.82 30.38,17.63 arc(30.51,17.5) 30.64,17.63 30.64,17.82 arc(30.76,17.95) 30.89,17.82 30.89,17.63 arc(31.02,17.5) 31.15,17.63 31.15,17.82 arc(31.27,17.95) 31.4,17.82 31.4,17.63 arc(31.53,17.5) 31.65,17.63 31.65,17.82 arc(31.78,17.95) 31.91,17.82 31.91,17.63 arc(32.03,17.5) 32.16,17.63 32.16,17.82 arc(32.29,17.95) 32.42,17.82 32.42,17.63 arc(32.54,17.5) 32.67,17.63 32.67,17.82 arc(32.8,17.95) 32.92,17.82 32.92,17.63 arc(33.05,17.5) 33.18,17.63 33.18,17.82 arc(33.21,17.91) 33.3,17.95 33.76,17.95 34.15,18.34 arc(34.24,18.38) 34.33,18.34 34.39,18.28 arc(34.57,18.28) 34.57,18.46 34.51,18.52 arc(34.51,18.7) 34.69,18.7 34.75,18.64 arc(34.93,18.64) 34.93,18.82 34.87,18.88 arc(34.84,18.97) 34.87,19.06 35.22,19.41 39.31,19.41 40.53,18.19 40.53,16.17 40.66,16.04 40.66,15.36 41.29,14.73 42.39,14.73 42.77,15.11
DDR_A4: length 32.8
  Top Layer w0.127: 37.97,15.11 37.16,15.11 36.49,15.78 36.49,16.86 37.14,17.51 38.11,17.51 38.31,17.3 38.9,17.3 v1(39.06,17.47) ; 20.32,11.75 v1(20.32,12.2)
  Bottom Layer w0.127: v1(20.32,12.2) 20.05,12.48 20.05,15.69 24.74,20.39 37.15,20.39 39.26,18.28 39.26,17.66 v1(39.06,17.47)
DDR_A5: length 32.8
  Top Layer w0.127: 23.07,14.5 23.08,14.5 23.53,14.5 24.75,15.71 arc(24.79,15.8) 24.75,15.89 24.61,16.03 arc(24.61,16.21) 24.79,16.21 24.93,16.07 arc(25.11,16.07) 25.11,16.25 24.97,16.39 arc(24.97,16.57) 25.15,16.57 25.29,16.43 arc(25.47,16.43) 25.47,16.61 25.33,16.75 arc(25.33,16.93) 25.51,16.93 25.65,16.79 arc(25.83,16.79) 25.83,16.97 25.69,17.11 arc(25.69,17.29) 25.87,17.29 26.01,17.15 arc(26.18,17.15) 26.19,17.33 26.04,17.47 arc(26.05,17.65) 26.22,17.65 26.36,17.51 arc(26.54,17.51) 26.54,17.69 26.4,17.83 arc(26.4,18.01) 26.58,18.01 26.72,17.87 arc(26.81,17.83) 26.9,17.87 27.36,18.32 27.66,18.32 arc(27.75,18.36) 27.78,18.45 27.78,18.65 arc(27.91,18.78) 28.04,18.65 28.04,18.45 arc(28.16,18.32) 28.29,18.45 28.29,18.65 arc(28.42,18.78) 28.54,18.65 28.54,18.45 arc(28.67,18.32) 28.8,18.45 28.8,18.65 arc(28.93,18.78) 29.05,18.65 29.05,18.45 arc(29.18,18.32) 29.31,18.45 29.31,18.65 arc(29.43,18.78) 29.56,18.65 29.56,18.45 arc(29.69,18.32) 29.81,18.45 29.81,18.65 arc(29.94,18.78) 30.07,18.65 30.07,18.45 arc(30.2,18.32) 30.32,18.45 30.32,18.61 arc(30.45,18.73) 30.58,18.61 30.58,18.45 arc(30.61,18.36) 30.7,18.32 33.42,18.32 35.01,19.92 39.32,19.92 40.96,18.28 40.96,15.62 41.48,15.11 41.97,15.11
DDR_A6: length 32.8
  Top Layer w0.127: v1(22.62,14.5) 22.16,14.5 ; 38.77,15.11 38.39,15.49 v1(38.39,15.5)
  Bottom Layer w0.127: v1(38.39,15.5) 37.8,16.1 36.97,16.1 36.02,17.05 35.72,17.05 arc(35.63,17.02) 35.59,16.93 35.59,16.91 arc(35.47,16.79) 35.34,16.91 35.34,16.93 arc(35.3,17.02) 35.21,17.05 35.08,17.05 arc(34.99,17.02) 34.95,16.93 34.95,16.7 arc(34.83,16.58) 34.7,16.7 34.7,16.93 arc(34.57,17.05) 34.44,16.93 34.44,16.7 arc(34.32,16.58) 34.19,16.7 34.19,16.93 arc(34.06,17.05) 33.94,16.93 33.94,16.7 arc(33.81,16.58) 33.68,16.7 33.68,16.93 arc(33.56,17.05) 33.43,16.93 33.43,16.7 arc(33.3,16.58) 33.17,16.7 33.17,16.93 arc(33.05,17.05) 32.92,16.93 32.92,16.7 arc(32.79,16.58) 32.67,16.7 32.67,16.93 arc(32.54,17.05) 32.41,16.93 32.41,16.7 arc(32.29,16.58) 32.16,16.7 32.16,16.93 arc(32.03,17.05) 31.9,16.93 31.9,16.7 arc(31.78,16.58) 31.65,16.7 31.65,16.93 arc(31.52,17.05) 31.4,16.93 31.4,16.7 arc(31.27,16.58) 31.14,16.7 31.14,16.93 arc(31.02,17.05) 30.89,16.93 30.89,16.7 arc(30.76,16.58) 30.63,16.7 30.63,16.93 arc(30.51,17.05) 30.38,16.93 30.38,16.7 arc(30.25,16.58) 30.13,16.7 30.13,16.93 arc(30,17.05) 29.87,16.93 29.87,16.7 arc(29.75,16.58) 29.62,16.7 29.62,16.93 arc(29.49,17.05) 29.36,16.93 29.36,16.7 arc(29.24,16.58) 29.11,16.7 29.11,16.93 arc(28.98,17.05) 28.86,16.93 28.86,16.7 arc(28.73,16.58) 28.6,16.7 28.6,16.93 arc(28.48,17.05) 28.35,16.93 28.35,16.7 arc(28.22,16.58) 28.09,16.7 28.09,16.93 arc(27.97,17.05) 27.84,16.93 27.84,16.7 arc(27.71,16.58) 27.59,16.7 27.59,16.93 arc(27.46,17.05) 27.33,16.93 27.33,16.7 arc(27.21,16.58) 27.08,16.7 27.08,16.93 arc(26.95,17.05) 26.82,16.93 26.82,16.7 arc(26.7,16.58) 26.57,16.7 26.57,16.93 arc(26.44,17.05) 26.32,16.93 26.32,16.7 arc(26.19,16.58) 26.06,16.7 26.06,16.93 arc(25.94,17.05) 25.81,16.93 25.81,16.7 arc(25.68,16.58) 25.55,16.7 25.55,16.93 arc(25.52,17.02) 25.43,17.05 25.16,17.05 22.62,14.51 v1(22.62,14.5)
DDR_A7: length 32.7
  Top Layer w0.127: 42.77,15.91 42.4,15.53 41.64,15.53 41.3,15.87 41.3,18.49 39.39,20.39 34.82,20.39 34.09,19.66 33.61,19.66 arc(33.52,19.7) 33.48,19.79 33.48,20.39 arc(33.35,20.51) 33.23,20.39 33.23,19.79 arc(33.1,19.66) 32.97,19.79 32.97,20.39 arc(32.85,20.51) 32.72,20.39 32.72,19.79 arc(32.59,19.66) 32.47,19.79 32.47,20.39 arc(32.34,20.51) 32.21,20.39 32.21,19.79 arc(32.09,19.66) 31.96,19.79 31.96,20.39 arc(31.83,20.51) 31.7,20.39 31.7,19.79 arc(31.58,19.66) 31.45,19.79 31.45,20.18 arc(31.32,20.3) 31.2,20.18 31.2,19.79 arc(31.16,19.7) 31.07,19.66 26.88,19.66 23.07,15.85 23.07,15.42
DDR_A8: length 32.8
  Top Layer w0.127: 21.7,14.05 21.7,14.05 v1(21.7,14.53) ; 37.97,15.91 37.8,15.91 37.1,16.61 v1(36.99,16.61)
  Bottom Layer w0.127: v1(21.7,14.53) 22.15,14.98 22.66,14.98 25.48,17.8 25.83,17.8 arc(25.92,17.76) 25.96,17.67 25.96,17.5 arc(26.09,17.37) 26.21,17.5 26.21,17.67 arc(26.34,17.8) 26.47,17.67 26.47,17.5 arc(26.59,17.37) 26.72,17.5 26.72,17.67 arc(26.85,17.8) 26.97,17.67 26.97,17.5 arc(27.1,17.37) 27.23,17.5 27.23,17.67 arc(27.36,17.8) 27.48,17.67 27.48,17.5 arc(27.61,17.37) 27.74,17.5 27.74,17.67 arc(27.86,17.8) 27.99,17.67 27.99,17.5 arc(28.12,17.37) 28.24,17.5 28.24,17.67 arc(28.37,17.8) 28.5,17.67 28.5,17.5 arc(28.63,17.37) 28.75,17.5 28.75,17.67 arc(28.88,17.8) 29.01,17.67 29.01,17.5 arc(29.13,17.37) 29.26,17.5 29.26,17.67 arc(29.39,17.8) 29.51,17.67 29.51,17.5 arc(29.64,17.37) 29.77,17.5 29.77,17.67 arc(29.9,17.8) 30.02,17.67 30.02,17.5 arc(30.15,17.37) 30.28,17.5 30.28,17.67 arc(30.4,17.8) 30.53,17.67 30.53,17.5 arc(30.66,17.37) 30.78,17.5 30.78,17.67 arc(30.91,17.8) 31.04,17.67 31.04,17.5 arc(31.17,17.37) 31.29,17.5 31.29,17.67 arc(31.42,17.8) 31.55,17.67 31.55,17.5 arc(31.67,17.37) 31.8,17.5 31.8,17.67 arc(31.93,17.8) 32.05,17.67 32.05,17.5 arc(32.18,17.37) 32.31,17.5 32.31,17.67 arc(32.44,17.8) 32.56,17.67 32.56,17.5 arc(32.69,17.37) 32.82,17.5 32.82,17.67 arc(32.94,17.8) 33.07,17.67 33.07,17.5 arc(33.2,17.37) 33.32,17.5 33.32,17.67 arc(33.45,17.8) 33.58,17.67 33.58,17.5 arc(33.71,17.37) 33.83,17.5 33.83,17.67 arc(33.96,17.8) 34.09,17.67 34.09,17.5 arc(34.21,17.37) 34.34,17.5 34.34,17.67 arc(34.47,17.8) 34.59,17.67 34.59,17.5 arc(34.72,17.37) 34.85,17.5 34.85,17.67 arc(34.89,17.76) 34.98,17.8 35.1,17.8 arc(35.19,17.76) 35.23,17.67 35.23,17.65 arc(35.35,17.53) 35.48,17.65 35.48,17.67 arc(35.52,17.76) 35.61,17.8 35.8,17.8 35.97,17.63 arc(36.05,17.59) 36.14,17.63 36.44,17.93 arc(36.62,17.93) 36.62,17.75 36.32,17.45 arc(36.32,17.27) 36.5,17.27 36.8,17.57 arc(36.98,17.57) 36.98,17.39 36.68,17.09 arc(36.65,17) 36.68,16.91 v1(36.99,16.61)
DDR_A9: length 32.8
  Top Layer w0.127: 22.62,15.88 27.58,20.85 27.81,20.85 arc(27.9,20.81) 27.94,20.72 27.94,20.21 arc(28.06,20.09) 28.19,20.21 28.19,20.72 arc(28.32,20.85) 28.44,20.72 28.44,20.21 arc(28.57,20.09) 28.7,20.21 28.7,20.72 arc(28.82,20.85) 28.95,20.72 28.95,20.21 arc(29.08,20.09) 29.2,20.21 29.2,20.72 arc(29.33,20.85) 29.46,20.72 29.46,20.21 arc(29.59,20.09) 29.71,20.21 29.71,20.72 arc(29.84,20.85) 29.97,20.72 29.97,20.21 arc(30.09,20.09) 30.22,20.21 30.22,20.72 arc(30.35,20.85) 30.47,20.72 30.47,20.21 arc(30.6,20.09) 30.73,20.21 30.73,20.72 arc(30.77,20.81) 30.86,20.85 39.49,20.85 41.6,18.74 41.6,16.28 41.97,15.91
DDR_A10: length 32.7
  Top Layer w0.127: 42.77,14.31 42.82,14.31 43.22,14.71 ; 20.78,13.13 20.85,13.2 v1(20.85,13.66)
  Bottom Layer w0.127: v1(43.18,14.68) 43.18,15.05 42.95,15.28 41.86,15.28 arc(41.77,15.32) 41.73,15.41 41.73,16.1 arc(41.6,16.23) 41.47,16.1 41.47,15.41 arc(41.44,15.32) 41.35,15.28 40.55,15.28 39.84,14.57 39.39,14.57 39.04,14.92 39.04,15.97 38.22,16.79 38.22,17.76 36.33,19.65 25.13,19.65 20.85,15.37 v1(20.85,13.66)
DDR_A11: length 32.8
  Top Layer w0.127: 38.77,15.91 38.37,16.32 37.82,16.32 37.39,16.74 v1(37.39,16.95) ; v1(22.61,15.43) 22.61,15.42 22.16,15.42
  Bottom Layer w0.127: v1(22.61,15.43) 25.73,18.55 25.93,18.55 arc(26.02,18.51) 26.06,18.42 26.06,18.23 arc(26.19,18.11) 26.31,18.23 26.31,18.42 arc(26.44,18.55) 26.57,18.42 26.57,18.23 arc(26.69,18.11) 26.82,18.23 26.82,18.42 arc(26.95,18.55) 27.07,18.42 27.07,18.23 arc(27.2,18.11) 27.33,18.23 27.33,18.42 arc(27.46,18.55) 27.58,18.42 27.58,18.23 arc(27.71,18.11) 27.84,18.23 27.84,18.42 arc(27.96,18.55) 28.09,18.42 28.09,18.23 arc(28.22,18.11) 28.34,18.23 28.34,18.42 arc(28.47,18.55) 28.6,18.42 28.6,18.23 arc(28.73,18.11) 28.85,18.23 28.85,18.42 arc(28.98,18.55) 29.11,18.42 29.11,18.23 arc(29.23,18.11) 29.36,18.23 29.36,18.42 arc(29.49,18.55) 29.61,18.42 29.61,18.23 arc(29.74,18.11) 29.87,18.23 29.87,18.42 arc(30,18.55) 30.12,18.42 30.12,18.23 arc(30.25,18.11) 30.38,18.23 30.38,18.42 arc(30.5,18.55) 30.63,18.42 30.63,18.23 arc(30.76,18.11) 30.88,18.23 30.88,18.42 arc(31.01,18.55) 31.14,18.42 31.14,18.23 arc(31.27,18.11) 31.39,18.23 31.39,18.42 arc(31.52,18.55) 31.65,18.42 31.65,18.23 arc(31.77,18.11) 31.9,18.23 31.9,18.42 arc(32.03,18.55) 32.15,18.42 32.15,18.23 arc(32.28,18.11) 32.41,18.23 32.41,18.42 arc(32.54,18.55) 32.66,18.42 32.66,18.23 arc(32.79,18.11) 32.92,18.23 32.92,18.42 arc(33.04,18.55) 33.17,18.42 33.17,18.23 arc(33.3,18.11) 33.42,18.23 33.42,18.42 arc(33.55,18.55) 33.68,18.42 33.68,18.23 arc(33.81,18.11) 33.93,18.23 33.93,18.42 arc(34.06,18.55) 34.19,18.42 34.19,18.23 arc(34.31,18.11) 34.44,18.23 34.44,18.42 arc(34.57,18.55) 34.69,18.42 34.69,18.23 arc(34.82,18.11) 34.95,18.23 34.95,18.42 arc(35.08,18.55) 35.2,18.42 35.2,18.23 arc(35.33,18.11) 35.46,18.23 35.46,18.42 arc(35.58,18.55) 35.71,18.42 35.71,18.23 arc(35.84,18.11) 35.96,18.23 35.96,18.42 arc(36,18.51) 36.09,18.55 36.41,18.55 37.39,17.56 v1(37.39,16.95)
DDR_A12: length 32.7
  Top Layer w0.127: 42.77,16.71 42.77,19.04 42.69,19.13 arc(42.6,19.16) 42.51,19.13 42.22,18.84 arc(42.04,18.84) 42.04,19.02 42.33,19.31 arc(42.33,19.49) 42.15,19.49 41.86,19.19 arc(41.68,19.2) 41.68,19.37 41.97,19.66 arc(41.97,19.84) 41.79,19.84 41.5,19.55 arc(41.32,19.55) 41.32,19.73 41.61,20.02 arc(41.61,20.2) 41.43,20.2 41.14,19.91 arc(40.96,19.91) 40.96,20.09 41.25,20.38 arc(41.25,20.56) 41.07,20.56 40.78,20.27 arc(40.6,20.27) 40.6,20.45 40.89,20.74 arc(40.93,20.83) 40.89,20.92 40.58,21.23 27.52,21.23 21.71,15.43 21.71,14.98 21.7,14.96
DDR_A14_BA0: length 32.8
  Top Layer w0.127: 21.24,14.5 21.26,14.53 v1(21.26,14.98) ; 42.77,13.51 43.16,13.12 v1(43.16,13.12)
  Bottom Layer w0.127: v1(43.16,13.12) 43.16,12.92 43.01,12.77 40.8,12.77 38.78,14.8 38.78,15.82 37.89,16.7 37.89,17.62 36.18,19.33 25.35,19.33 24.74,18.71 arc(24.7,18.62) 24.74,18.53 24.78,18.5 arc(24.78,18.32) 24.6,18.32 24.56,18.35 arc(24.38,18.35) 24.38,18.17 24.52,18.03 arc(24.52,17.86) 24.34,17.86 24.2,17.99 arc(24.02,17.99) 24.02,17.81 24.16,17.68 arc(24.16,17.5) 23.98,17.5 23.84,17.63 arc(23.66,17.63) 23.66,17.45 23.8,17.32 arc(23.8,17.14) 23.62,17.14 23.48,17.27 arc(23.3,17.27) 23.3,17.1 23.44,16.96 arc(23.44,16.78) 23.26,16.78 23.12,16.92 arc(22.94,16.92) 22.94,16.74 23.08,16.6 arc(23.08,16.42) 22.9,16.42 22.76,16.56 arc(22.67,16.59) 22.58,16.56 21.26,15.23 v1(21.26,14.98)
DDR_A15_BA1: length 32.8
  Top Layer w0.127: 41.97,13.51 42.38,13.92 43.51,13.92 44.18,14.59 44.18,18.13 40.64,21.67 27.03,21.67 21.71,16.35 21.71,15.9 21.7,15.88
DDR_CAS: length 32.8
  Top Layer w0.127: v1(24.87,14.39) 24.52,14.05 24.45,14.05 ; 38.39,13.85 38.73,13.51 38.77,13.51
  Bottom Layer w0.127: v1(24.87,14.39) 25.05,14.57 25.85,14.57 26.87,13.55 28.88,13.55 29.85,12.59 arc(29.94,12.55) 30.03,12.59 30.19,12.75 arc(30.37,12.76) 30.37,12.58 30.21,12.41 arc(30.17,12.32) 30.21,12.23 30.4,12.03 30.58,12.03 arc(30.67,12.07) 30.7,12.16 30.7,12.71 arc(30.83,12.83) 30.96,12.71 30.96,12.16 arc(31.08,12.03) 31.21,12.16 31.21,12.68 arc(31.34,12.81) 31.46,12.68 31.46,12.16 arc(31.59,12.03) 31.72,12.16 31.72,12.71 arc(31.85,12.83) 31.97,12.71 31.97,12.16 arc(32.1,12.03) 32.23,12.16 32.23,12.71 arc(32.35,12.83) 32.48,12.71 32.48,12.16 arc(32.61,12.03) 32.73,12.16 32.73,12.71 arc(32.86,12.83) 32.99,12.71 32.99,12.16 arc(33.12,12.03) 33.24,12.16 33.24,12.71 arc(33.37,12.83) 33.5,12.71 33.5,12.16 arc(33.62,12.03) 33.75,12.16 33.75,12.71 arc(33.88,12.83) 34,12.71 34,12.16 arc(34.13,12.03) 34.26,12.16 34.26,12.71 arc(34.39,12.83) 34.51,12.71 34.51,12.16 arc(34.55,12.07) 34.64,12.03 34.8,12.03 35.01,12.24 arc(35.05,12.33) 35.01,12.42 34.86,12.58 arc(34.86,12.76) 35.04,12.76 35.19,12.6 arc(35.28,12.57) 35.37,12.6 35.48,12.71 36.39,12.71 36.44,12.76 arc(36.48,12.85) 36.44,12.94 36.21,13.17 arc(36.21,13.35) 36.39,13.35 36.62,13.12 arc(36.71,13.08) 36.8,13.12 37.1,13.42 arc(37.14,13.51) 37.1,13.6 36.93,13.77 arc(36.93,13.95) 37.11,13.95 37.28,13.78 arc(37.37,13.74) 37.46,13.78 37.53,13.85 37.86,13.85 arc(37.95,13.82) 37.98,13.73 37.98,12.84 arc(38.11,12.71) 38.24,12.84 38.24,13.73 arc(38.27,13.82) 38.36,13.85 v1(38.39,13.85)
DDR_CLKN: length 32.7
  Top Layer w0.127: 21.24,12.67 21.27,12.7 22.36,12.7 22.65,12.41 22.65,12.04 v1(22.92,11.77) ; v1(37.57,13.11) 37.76,13.11 37.97,12.9 37.97,12.71
  Bottom Layer w0.089: 24.14,12.78 24.31,12.95
  Bottom Layer w0.127: v1(22.92,11.77) 23.7,12.55 23.91,12.55 24.14,12.78 ; v1(37.57,13.11) 37.33,12.87 37.1,12.87 36.74,12.5 36.74,12.27 36.01,11.54 35.71,11.54 arc(35.37,11.4) 35.23,11.06 35.23,11.03 arc(35.07,10.88) 34.92,11.03 34.92,11.06 arc(34.44,11.54) 33.96,11.06 33.96,10.27 arc(33.8,10.12) 33.65,10.27 33.65,11.06 arc(33.17,11.54) 32.69,11.06 32.69,10.27 arc(32.53,10.12) 32.38,10.27 32.38,11.06 arc(31.9,11.54) 31.42,11.06 31.42,10.27 arc(31.26,10.12) 31.11,10.27 31.11,11.06 arc(30.63,11.54) 30.15,11.06 30.15,10.27 arc(29.99,10.12) 29.84,10.27 29.84,11.06 arc(29.7,11.4) 29.36,11.54 28.61,11.54 28.36,11.8 arc(28.31,11.9) 28.36,12.01 28.66,12.31 arc(28.65,12.99) 27.97,12.99 27.67,12.69 arc(27.57,12.65) 27.46,12.69 27.07,13.08 26.38,13.08 arc(26.27,13.12) 26.22,13.23 26.22,13.54 arc(26.07,13.7) 25.92,13.54 25.92,13.23 arc(25.87,13.12) 25.77,13.08 25.66,13.08 25.15,13.59 24.75,13.59 24.57,13.41 24.57,13.21 24.31,12.95
DDR_CLKP: length 32.7
  Top Layer w0.127: 37.97,11.91 37.58,12.3 ; 24.91,13.59 24.91,13.17 v1(24.92,13.16)
  Bottom Layer w0.127: v1(24.92,13.16) 24.92,13.14 25.32,12.75 25.52,12.75 arc(25.6,12.71) 25.63,12.63 arc(25.67,12.55) 25.75,12.52 25.82,12.52 arc(25.9,12.55) 25.94,12.63 arc(25.97,12.71) 26.05,12.75 26.13,12.75 arc(26.21,12.71) 26.24,12.63 arc(26.28,12.55) 26.36,12.52 26.43,12.52 arc(26.51,12.55) 26.55,12.63 arc(26.58,12.71) 26.66,12.75 26.78,12.75 26.88,12.64 26.88,12.56 26.65,12.32 26.65,12.23 26.74,12.14 26.84,12.14 27.1,12.4 27.29,12.4 27.35,12.33 27.45,12.33 arc(27.7,12.34) 27.91,12.46 28.21,12.76 arc(28.42,12.76) 28.42,12.54 28.12,12.24 arc(27.98,11.9) 28.12,11.56 28.47,11.21 28.61,11.21 arc(28.72,11.17) 28.76,11.06 28.76,10.9 arc(28.91,10.75) 29.06,10.9 29.06,11.06 arc(29.11,11.17) 29.22,11.21 29.36,11.21 arc(29.47,11.17) 29.51,11.06 29.51,10.27 arc(29.99,9.79) 30.48,10.27 30.48,11.06 arc(30.63,11.21) 30.78,11.06 30.78,10.27 arc(31.26,9.79) 31.75,10.27 31.75,11.06 arc(31.9,11.21) 32.05,11.06 32.05,10.27 arc(32.53,9.79) 33.02,10.27 33.02,11.06 arc(33.17,11.21) 33.32,11.06 33.32,10.27 arc(33.8,9.79) 34.29,10.27 34.29,11.06 arc(34.44,11.21) 34.59,11.06 34.59,11.03 arc(35.07,10.55) 35.56,11.03 35.56,11.06 arc(35.6,11.17) 35.71,11.21 35.83,11.09 35.83,10.82 35.93,10.72 36.11,10.72 36.21,10.83 36.21,11 36.1,11.11 36.1,11.17 36.15,11.21 arc(36.26,11.26) 36.36,11.21 36.75,10.83 arc(36.97,10.83) 36.97,11.04 36.58,11.43 arc(36.58,11.65) 36.79,11.65 37.18,11.26 arc(37.4,11.26) 37.4,11.47 37.01,11.86 arc(36.97,11.97) 37.01,12.08 37.07,12.13 37.07,12.37 37.24,12.54 37.43,12.54 37.58,12.39 v1(37.58,12.3)
